# EAGLE design AFM_QFM_sensor_OPA656NB (EAGLE 9.6.2)
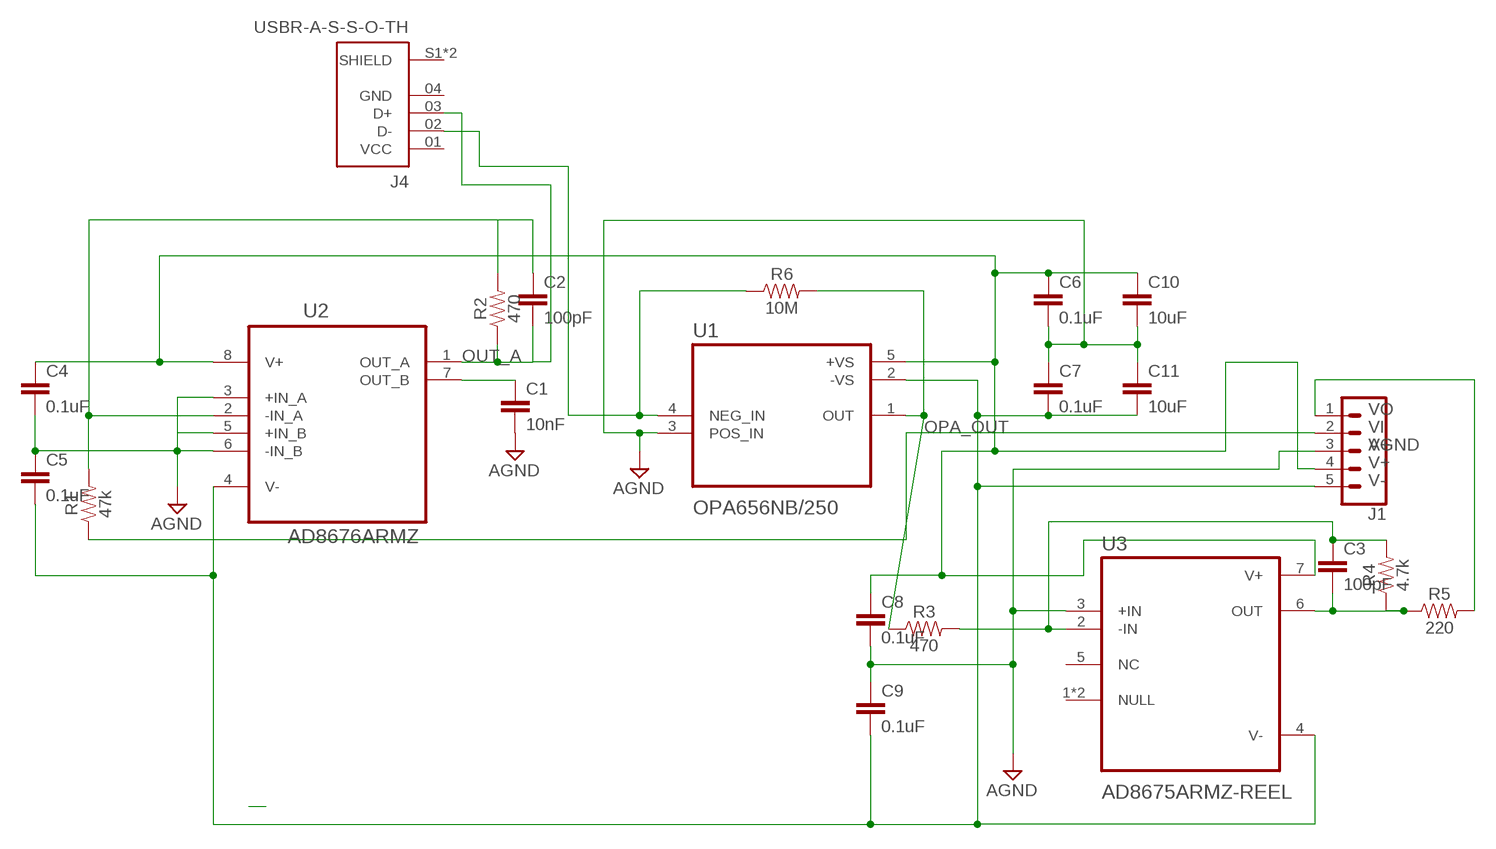
[diagram p0: schematic, sheet 1]

## Parts
C1  10nF  10NF-0603-50V-10%  [0603]
C2  100pF  100PF-0603-50V-5%  [0603]
C3  100pF  100PF-0603-50V-5%  [0603]
C4  0.1uF  0.1UF-0603-25V-(+80/-20%)  [0603]
C5  0.1uF  0.1UF-0603-25V-(+80/-20%)  [0603]
C6  0.1uF  0.1UF-0603-25V-(+80/-20%)  [0603]
C7  0.1uF  0.1UF-0603-25V-(+80/-20%)  [0603]
C8  0.1uF  0.1UF-0603-25V-(+80/-20%)  [0603]
C9  0.1uF  0.1UF-0603-25V-(+80/-20%)  [0603]
C10  10uF  10UF-0805-10V-10%  [0805]
C11  10uF  10UF-0805-10V-10%  [0805]
J1  CONN_05PTH_LONGPADS  [1X05_LONGPADS]
J4  USBR-A-S-S-O-TH  [SAMTEC_USBR-A-S-S-O-TH]
R1  47k  47KOHM-0603-1/10W-1%  [0603]
R2  470  47OHM-0603-1/10W-1%  [0603]
R3  470  470OHM-0603-1/10W-1%  [0603]
R4  4.7k  4.7KOHM-0603-1/10W-1%  [0603]
R5  220  220OHM-0603-1/10W-1%  [0603]
R6  10M  1MOHM-0603-1/4W-5%  [0603]
U1  OPA656NB/250  [SOT95P280X145-5N]
U2  AD8676ARMZ  [SOP65P490X110-8N]
U3  AD8675ARMZ-REEL  [SOP65P490X110-8N]

## Nets
AGND: C1.2 C4.2 C5.1 C6.2 C7.1 C8.2 C9.1 C10.2 C11.1 J1.3 U1.3(POS_IN) U2.3(+IN_A) U2.5(+IN_B) U2.6(-IN_B) U3.3(+IN)
N$3: J4.02(D-) R6.1 U1.4(NEG_IN)
N$6: C1.1 U2.7(OUT_B)
N$7: C2.1 R1.2 R2.2 U2.2(-IN_A)
N$8: C3.2 R4.1 R5.1 U3.6(OUT)
OPA_OUT: C3.1 R3.1 R3.2 R4.2 R6.2 U1.1(OUT) U3.2(-IN)
OUT_A: C2.2 J4.03(D+) R2.1 U2.1(OUT_A)
V+: C4.1 C6.1 C8.1 C10.1 J1.4 U1.5(+VS) U2.8(V+) U3.7(V+)
V-: C5.2 C7.2 C9.2 C11.2 J1.5 U1.2(-VS) U2.4(V-) U3.4(V-)
VI: J1.2 R1.1
VO: J1.1 R5.2
Unconnected: J4.S1(SHIELD) J4.S2(SHIELD) U3.1(NULL) U3.5(NC) U3.8(NULL)

## Power pins joined to a net without a drawn wire
GND: J4.04(GND)
VCC: J4.01(VCC)

## Library data of the parts
C1 = SparkFun-Capacitors:10NF: 0.01uF/10nF/10,000pF ceramic capacitors A capacitor is a passive two-terminal electrical component used to store electrical energy temporarily in an electric field. CAP-09321; PROD_ID: CAP-00867
C2 C3 = SparkFun-Capacitors:100PF: 100pF/0.1nF ceramic capacitors A capacitor is a passive two-terminal electrical component used to store electrical energy temporarily in an electric field.; PROD_ID: CAP-07883
C4-C9 = SparkFun-Capacitors:0.1UF: 0.1µF ceramic capacitors A capacitor is a passive two-terminal electrical component used to store electrical energy temporarily in an electric field.; PROD_ID: CAP-00810
C10 C11 = SparkFun-Capacitors:10UF: 10.0µF ceramic capacitors A capacitor is a passive two-terminal electrical component used to store electrical energy temporarily in an electric field.; PROD_ID: CAP-11330
J1 = SparkFun-Connectors:CONN_05: Multi connection point. Often used as Generic Header-pin footprint for 0.1 inch spaced/style header connections On any of the 0.1 inch spaced packages, you can populate with these: Break Away Headers - Straight <https://www.sparkfun.com/products/116> (PRT-00116) Break Away Male Headers - Right Angle <https://www.sparkfun.com/products/553> (PRT-00553) Female Headers <https://www.sparkfun.com/products/115> (PRT-00115) Break Away Headers - Machine Pin <https://www.sparkfun.com/products/117> (PRT-00117) Break Away Female Headers - Swiss Machine Pin <https://www.sparkfun.com/products/743> (PRT-00743) For SCREWTERMINALS and SPRING TERMINALS visit here: Screw Terimnals on SparkFun.com <https://www.sparkfun.com/search/results?term=Screw+Terminals> (5mm/3.5mm/2.54mm spacing) This device is also useful as a general connection point to wire up your design to another part of your project. Our various solder wires solder well into these plated through hole pads. Hook-Up Wire - Assortment (Stranded, 22 AWG) <https://www.sparkfun.com/products/11375> (PRT-11375) Hook-Up Wire - Assortment (Solid Core, 22 AWG) <https://www.sparkfun.com/products/11367> (PRT-11367) View the entire wire category on our website here <https://www.sparkfun.com/categories/141> Special notes: Molex polarized connector foot print use with SKU : PRT-08231 with associated crimp pins and housings. 1MM SMD Version SKU: PRT-10208
J4 = USBR-A-S-S-O-TH:USBR-A-S-S-O-TH: USB TYPE A CONNECTOR Check availability <https://pricing.snapeda.com/parts/USBR-A-S-S-O-TH/Samtec/view-part?ref=eda>; AVAILABILITY: In Stock; CHECK_PRICES: https://www.snapeda.com/parts/USBR-A-S-S-O-TH/Samtec+Inc./view-part/?ref=eda; DESCRIPTION: USB-A (USB TYPE-A) USB 2.0 Receptacle Connector 4 Position Through Hole, Right Angle; MF: Samtec; MP: USBR-A-S-S-O-TH; PACKAGE: None; PRICE: None; SNAPEDA_LINK: https://www.snapeda.com/parts/USBR-A-S-S-O-TH/Samtec+Inc./view-part/?ref=snap
R1 = SparkFun-Resistors:47KOHM: 47kΩ resistor A resistor is a passive two-terminal electrical component that implements electrical resistance as a circuit element. Resistors act to reduce current flow, and, at the same time, act to lower voltage levels within circuits. - Wikipedia; PROD_ID: RES-07871
R2 = SparkFun-Resistors:47OHM: 47Ω resistor A resistor is a passive two-terminal electrical component that implements electrical resistance as a circuit element. Resistors act to reduce current flow, and, at the same time, act to lower voltage levels within circuits. - Wikipedia; PROD_ID: RES-14282; VALUE: 47
R3 = SparkFun-Resistors:470OHM: 470Ω resistor A resistor is a passive two-terminal electrical component that implements electrical resistance as a circuit element. Resistors act to reduce current flow, and, at the same time, act to lower voltage levels within circuits. - Wikipedia; PROD_ID: RES-07869
R4 = SparkFun-Resistors:4.7KOHM: 4.7kΩ resistor A resistor is a passive two-terminal electrical component that implements electrical resistance as a circuit element. Resistors act to reduce current flow, and, at the same time, act to lower voltage levels within circuits. - Wikipedia; PROD_ID: RES-07857
R5 = SparkFun-Resistors:220OHM: 220Ω resistor A resistor is a passive two-terminal electrical component that implements electrical resistance as a circuit element. Resistors act to reduce current flow, and, at the same time, act to lower voltage levels within circuits. - Wikipedia; PROD_ID: RES-07861
R6 = SparkFun-Resistors:1MOHM: 1MΩ resistor A resistor is a passive two-terminal electrical component that implements electrical resistance as a circuit element. Resistors act to reduce current flow, and, at the same time, act to lower voltage levels within circuits. - Wikipedia; PROD_ID: RES-07868; VALUE: 1M
U1 = OPA656NB_250:OPA656NB/250: Check availability <https://pricing.snapeda.com/parts/OPA656NB/250/Texas%20Instruments/view-part?ref=eda>; AVAILABILITY: In Stock; CHECK_PRICES: https://www.snapeda.com/parts/OPA656NB/250/Texas+Instruments/view-part/?ref=eda; DESCRIPTION: Wideband, Unity Gain Stable FET-Input Operational Amplifier; MF: Texas Instruments; MP: OPA656NB/250; PACKAGE: SOT-23-5 Texas Instruments; PRICE: None; PURCHASE-URL: https://www.snapeda.com/api/url_track_click_mouser/?unipart_id=911932&manufacturer=Texas Instruments&part_name=OPA656NB/250&search_term=opa656; SNAPEDA_LINK: https://www.snapeda.com/parts/OPA656NB/250/Texas+Instruments/view-part/?ref=snap
U2 = AD8676ARMZ:AD8676ARMZ: Dual Rail-to-Rail Output Op Amp Check availability <https://pricing.snapeda.com/parts/AD8676ARMZ/Analog%20Devices/view-part?ref=eda>; AVAILABILITY: In Stock; CHECK_PRICES: https://www.snapeda.com/parts/AD8676ARMZ/Analog+Devices/view-part/?ref=eda; DESCRIPTION: Ultra Precision, 36 V, 2.8 nV/√Hz Dual RRO Op Amp; MF: Analog Devices; MP: AD8676ARMZ; PACKAGE: MSOP-8 Analog Devices; PRICE: None; PURCHASE-URL: https://www.snapeda.com/api/url_track_click_mouser/?unipart_id=599467&manufacturer=Analog Devices&part_name=AD8676ARMZ&search_term=ad8676; SNAPEDA_LINK: https://www.snapeda.com/parts/AD8676ARMZ/Analog+Devices/view-part/?ref=snap
U3 = AD8675ARMZ-REEL:AD8675ARMZ-REEL: Check availability <https://pricing.snapeda.com/parts/AD8675ARMZ/Analog%20Devices/view-part?ref=eda>; AVAILABILITY: In Stock; CHECK_PRICES: https://www.snapeda.com/parts/AD8675ARMZ/Analog+Devices/view-part/?ref=eda; DESCRIPTION: 36 V Precision, 2.8 nV/√Hz Rail-to-Rail Output Op Amp; MF: Analog Devices; MP: AD8675ARMZ; PACKAGE: MSOP-8 Analog Devices; PRICE: None; PURCHASE-URL: https://www.snapeda.com/api/url_track_click_mouser/?unipart_id=570787&manufacturer=Analog Devices&part_name=AD8675ARMZ&search_term=ad8675; SNAPEDA_LINK: https://www.snapeda.com/parts/AD8675ARMZ/Analog+Devices/view-part/?ref=snap

## Board
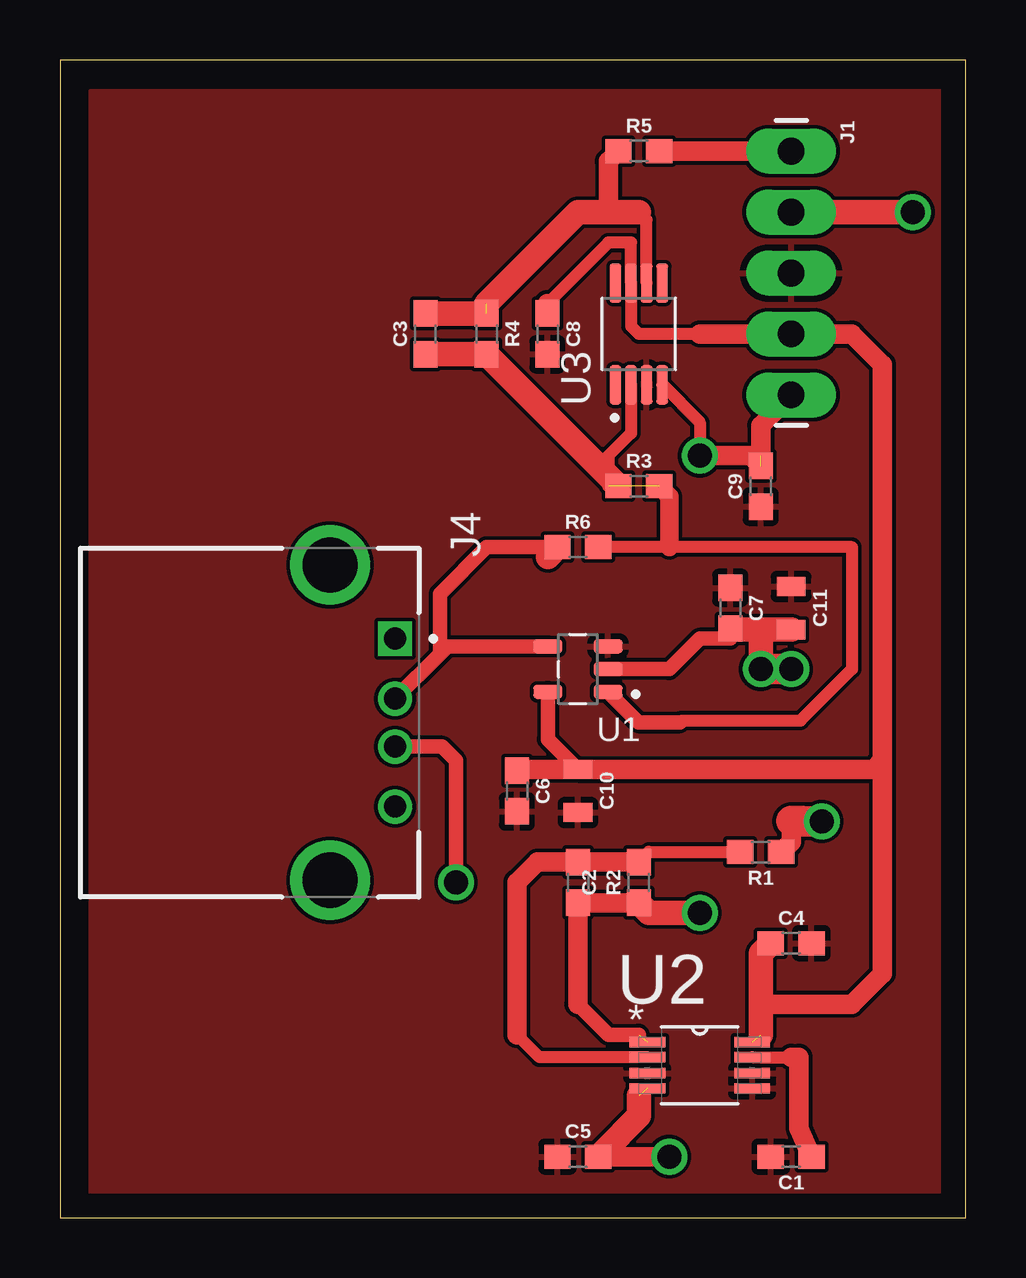
[diagram p1: board, top side]
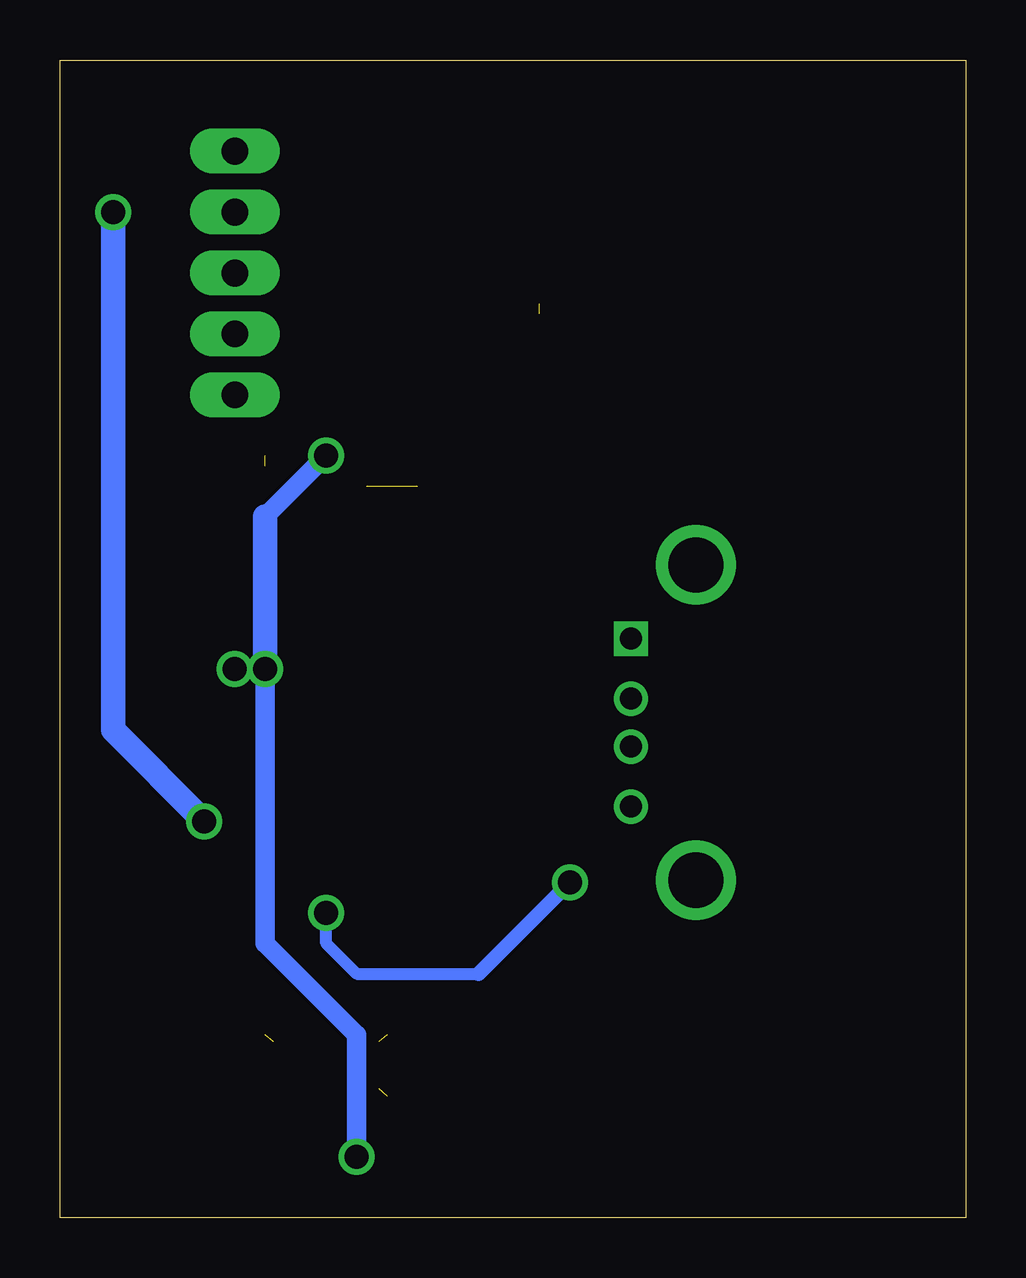
[diagram p2: board, bottom side, seen from below]

Size 37.77 x 48.25 mm. Coordinates in mm from the lower left corner, seen from the top.
Outline: 0,0 37.77,0 37.77,48.25 0,48.25 0,0
Copper layers (1*16): Top 0.035mm / dielectric 1.5mm / Bottom 0.035mm
Design rules "default": minimum track width 6mil, minimum drill 0.35mm, track to track 6mil, track to pad 6mil, pad to pad 6mil, via to via 6mil, smd to smd 6mil, copper to edge 40mil, drill to drill 6mil, minimum pad ring 10mil, minimum via ring 8mil, stop-mask expansion 4mil, vias tented up to drill 0mil, thermal gap 10mil

### Footprints (pad centres in the part's own frame; a part is rotated, then mirrored left to right if it is on the bottom)
0603 = smd 1.1 x 1: 1 -0.85,0; 2 0.85,0
0805 = smd 0.8 x 1.2: 1 -0.9,0; 2 0.9,0
1X05_LONGPADS = drill 1.118 pad 1.88 long: 1 0,0; 2 2.54,0; 3 5.08,0; 4 7.62,0; 5 10.16,0
SAMTEC_USBR-A-S-S-O-TH = drill 0.92 square: 01 0,0 | drill 0.92: 02 2.5,0; 03 4.5,0; 04 7,0 | drill 2.3: S1 -3.07,-2.71; S2 10.07,-2.71
SOT95P280X145-5N = smd 1.21 x 0.59: 1 -1.255,0.95; 2 -1.255,0; 3 -1.255,-0.95; 4 1.255,-0.95; 5 1.255,0.95
SOP65P490X110-8N = smd 1.499 x 0.432: 1 -2.184,0.965; 2 -2.184,0.33; 3 -2.184,-0.33; 4 -2.184,-0.965; 5 2.184,-0.965; 6 2.184,-0.33; 7 2.184,0.33; 8 2.184,0.965
SOP65P490X110-8N' = smd 1.62 x 0.48: 1 -2.12,0.975; 2 -2.12,0.325; 3 -2.12,-0.325; 4 -2.12,-0.975; 5 2.12,-0.975; 6 2.12,-0.325; 7 2.12,0.325; 8 2.12,0.975

### Placement (x,y rotation side)
C1  30.48,2.54 180 top
C2  21.59,13.97 270 top
C3  15.24,36.83 90 top
C4  30.48,11.43 0 top
C5  21.59,2.54 0 top
C6  19.05,17.78 270 top
C7  27.94,25.4 270 top
C8  20.32,36.83 270 top
C9  29.21,30.48 90 top
C10  21.59,17.78 270 top
C11  30.48,25.4 270 top
J1  30.48,44.45 270 top
J4  13.97,24.13 270 top
R1  29.21,15.24 180 top
R2  24.13,13.97 90 top
R3  24.13,30.48 0 top
R4  17.78,36.83 270 top
R5  24.13,44.45 0 top
R6  21.59,27.94 0 top
U1  21.59,22.86 180 top
U2  26.67,6.35 0 top
U3  AD8675ARMZ-REEL  [SOP65P490X110-8N']  24.13,36.83 90 top

### Tracks (layer width: path | path; a pad name or v marks a point on that pad's centre or on a via)
AGND
  pour Top (isolate 0.1, rank 6): 36.83,46.99 36.83,0 1.27,0 1.27,46.99
N$3
  Top 0.61: J4.02 15.83,23.5 | 15.83,23.5 15.83,26 17.78,27.94 R6.1 | U1.4 16.15,23.81 15.83,23.5
  Top 1.016: 20.34,27.54 R6.1
N$6
  Top 0.508: U2.7 30.48,6.68
  Top 0.813: 30.48,6.68 30.81,6.68 30.81,3.72 C1.1
N$7
  Top 0.508: R2.2 24.55,15.24 R1.2 | U2.2 19.99,6.68 19.05,7.62
  Top 0.813: 19.05,7.62 19.05,13.97 19.9,14.82 C2.1 R2.2
N$8  (1 unrouted)
  Top 0.508: U3.6 24.45,41.59 24.13,41.91
  Top 0.813: R5.1 22.86,44.03 22.86,41.91
  Top 1.016: C3.2 R4.1 | 24.13,41.91 22.86,41.91 21.59,41.91 17.78,38.1
OPA_OUT  (2 unrouted)
  Top 0.508: 25.84,20.64 25.91,20.71 30.87,20.71 33.02,22.86 33.02,27.94 25.4,27.94 R6.2 | U3.2 23.8,32.7 22.86,31.75 22.86,30.48
  Top 0.61: U1.1 24.11,20.64 25.84,20.64
  Top 0.762: R3.2 25.4,30.06 25.4,27.94
  Top 1.016: R3.1 R4.2 C3.1
OUT_A  (via drill 1 pad 1.3)  (1 unrouted)
  Top 0.61: 21.59,8.89 22.86,7.62 24.13,7.62 | v16.51,13.97 16.51,19.05 15.93,19.63 J4.03
  Top 0.813: R2.1 C2.2 21.59,8.89
  Top 1.016: v26.67,12.7 24.55,12.7 R2.1
  Bottom 0.508: 20.32,10.16 25.4,10.16 26.67,11.43 v26.67,12.7
  Bottom 0.61: 20.32,10.16 v16.51,13.97
V+  (1 unrouted)
  Top 0.508: 20.32,38.1 22.86,40.64 23.8,40.64 U3.7 23.8,37.16 24.13,36.83 26.67,36.83 | 21.03,19.24 21.41,18.86 C10.1
  Top 0.61: U1.5 20.34,19.93 21.41,18.86
  Top 0.813: 34.29,19.05 34.29,35.56 33.02,36.83 J1.4 26.67,36.83 | C6.1 19.1,18.68 C10.1 33.92,18.68 34.29,19.05 | C8.1 20.32,38.1 | 29.21,8.89 33.02,8.89 34.29,10.16 34.29,19.05
  Top 1.016: C4.1 29.21,11.01 29.21,8.89 29.21,7.62
V-  (via drill 1 pad 1.3)  (2 unrouted)
  Top 0.508: 27.94,24.13 C7.2 | U3.4 26.67,33.15 v26.67,31.75
  Top 0.61: 27.94,24.13 26.67,24.13 25.4,22.86 U1.2
  Top 0.813: C9.2 28.79,31.75 v26.67,31.75 | v25.4,2.54 22.86,2.54 22.65,2.75 | J1.5 29.21,33.02 29.21,31.75
  Top 1.016: C5.2 22.65,2.75 24.13,4.23 24.13,5.08 | C11.2 29.21,24.5 | 29.21,24.5 27.99,24.5 C7.2 | v29.21,22.86 29.21,24.5
  Top 1.27: v29.21,22.86 v30.48,22.86
  Bottom 0.813: v26.67,31.75 29.21,29.21 | v25.4,2.54 25.4,7.62 29.21,11.43 v29.21,22.86
  Bottom 1.016: 29.21,29.21 v29.21,22.86
VI  (via drill 1)
  Top 0.813: R1.1 30.48,15.66 30.48,16.53
  Top 1.016: v35.56,41.91 J1.2
  Top 1.27: v31.75,16.51 30.95,16.51 30.94,16.53 30.48,16.53
  Bottom 1.016: v35.56,41.91 35.56,20.32 v31.75,16.51
VO
  Top 0.813: R5.2 J1.1